# EAGLE schematic rx08-vrs (EAGLE 6.6.0)
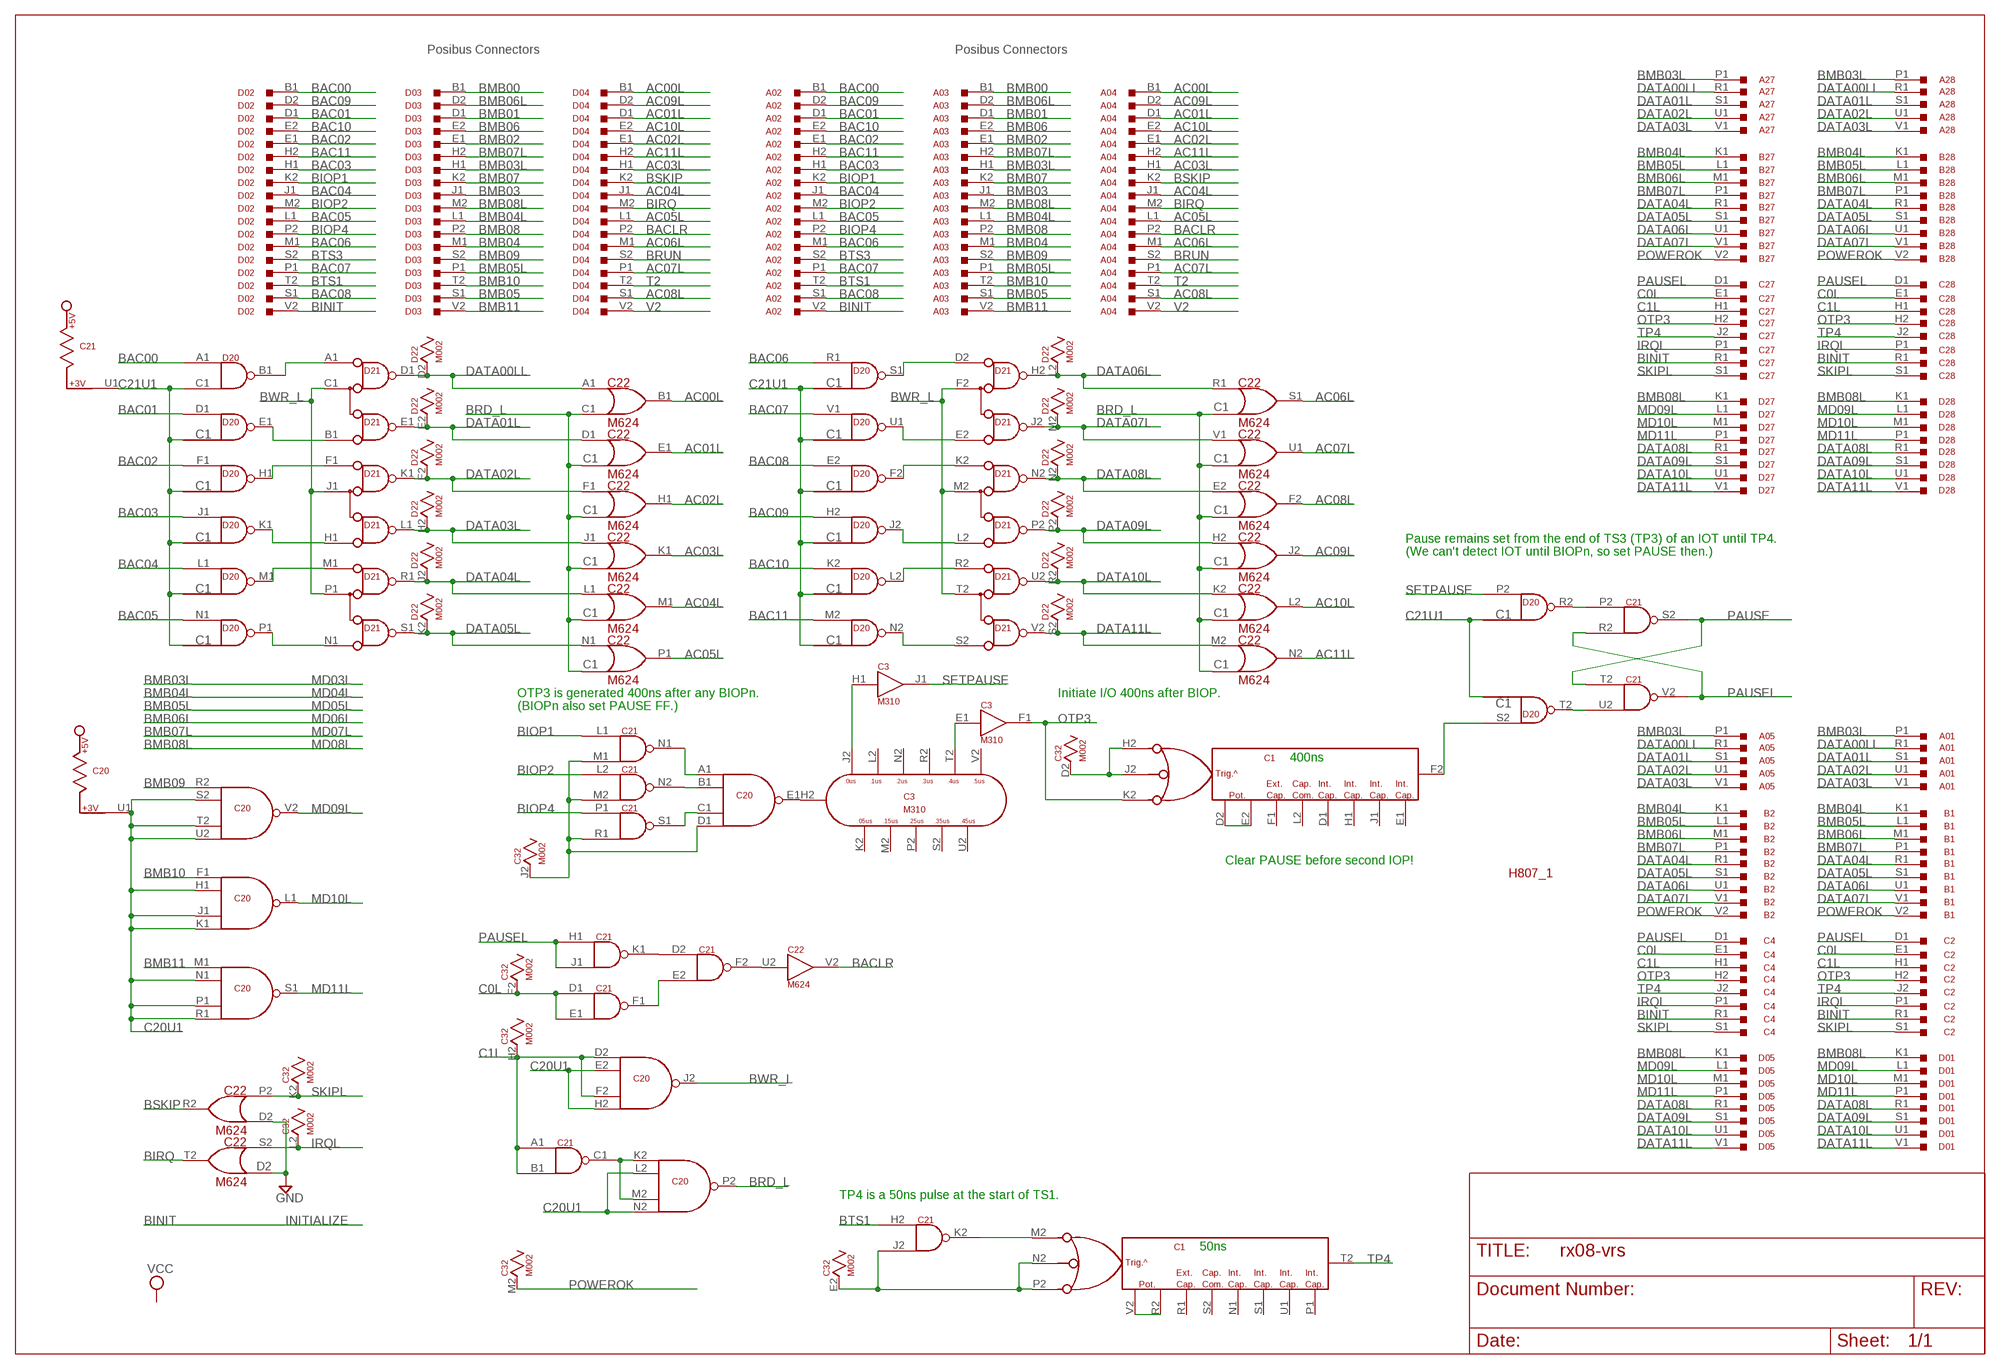
[diagram p0: schematic, sheet 1]

## Parts
A01  M916  [H807]
A02  M903  [H807]
A03  M903  [H807]
A04  M903  [H807]
A05  M916  [H807]
A27  M916  [H807]
A28  M916  [H807]
B1  M916  [H807]
B2  M916  [H807]
B27  M916  [H807]
B28  M916  [H807]
C1  M302  [H807]
C2  M916  [H807]
C3  M310  [H807]
C4  M916  [H807]
C20  M617  [H807]
C21  M113  [H807]
C22  M624  [H807]
C27  M916  [H807]
C28  M916  [H807]
C32  M002  [H807]
D01  M916  [H807]
D02  M903  [H807]
D03  M903  [H807]
D04  M903  [H807]
D05  M916  [H807]
D20  M101  [H807]
D21  M623  [H807]
D22  M002  [H807]
D27  M916  [H807]
D28  M916  [H807]
H807_1  H807  [H807]

## Nets
AC00L: A04.B1 C22.B1(B1:OUT) D04.B1
AC01L: A04.D1 C22.E1(E1:OUT) D04.D1
AC02L: A04.E1 C22.H1(H1:OUT) D04.E1
AC03L: A04.H1 C22.K1(K1:OUT) D04.H1
AC04L: A04.J1 C22.M1(M1:OUT) D04.J1
AC05L: A04.L1 C22.P1(P1:OUT) D04.L1
AC06L: A04.M1 C22.S1(S1:OUT) D04.M1
AC07L: A04.P1 C22.U1(U1:OUT) D04.P1
AC08L: A04.S1 C22.F2(F2:OUT) D04.S1
AC09L: A04.D2 C22.J2(J2:OUT) D04.D2
AC10L: A04.E2 C22.L2(L2:OUT) D04.E2
AC11L: A04.H2 C22.N2(N2:OUT) D04.H2
BAC00: A02.B1 D02.B1 D20.A1(B1:IN1)
BAC01: A02.D1 D02.D1 D20.D1(E1:IN)
BAC02: A02.E1 D02.E1 D20.F1(H1:IN)
BAC03: A02.H1 D02.H1 D20.J1(K1:IN)
BAC04: A02.J1 D02.J1 D20.L1(M1:IN)
BAC05: A02.L1 D02.L1 D20.N1(P1:IN)
BAC06: A02.M1 D02.M1 D20.R1(S1:IN)
BAC07: A02.P1 D02.P1 D20.V1(U1:IN)
BAC08: A02.S1 D02.S1 D20.E2(F2:IN)
BAC09: A02.D2 D02.D2 D20.H2(J2:IN)
BAC10: A02.E2 D02.E2 D20.K2(L2:IN)
BAC11: A02.H2 D02.H2 D20.M2(N2:IN)
BACLR: A04.P2 C22.V2(V2:OUT) D04.P2
BINIT: A02.V2 C2.R1 C4.R1 C27.R1 C28.R1 D02.V2
BIOP1: A02.K2 C21.L1(N1:IN1) D02.K2
BIOP2: A02.M2 C21.L2(N2:IN1) D02.M2
BIOP4: A02.P2 C21.P1(S1:IN1) D02.P2
BIRQ: A04.M2 C22.T2(T2:OUT) D04.M2
BMB00: A03.B1 D03.B1
BMB01: A03.D1 D03.D1
BMB02: A03.E1 D03.E1
BMB03: A03.J1 D03.J1
BMB03L: A01.P1 A03.H1 A05.P1 A27.P1 A28.P1 D03.H1
BMB04: A03.M1 D03.M1
BMB04L: A03.L1 B1.K1 B2.K1 B27.K1 B28.K1 D03.L1
BMB05: A03.S1 D03.S1
BMB05L: A03.P1 B1.L1 B2.L1 B27.L1 B28.L1 D03.P1
BMB06: A03.E2 D03.E2
BMB06L: A03.D2 B1.M1 B2.M1 B27.M1 B28.M1 D03.D2
BMB07: A03.K2 D03.K2
BMB07L: A03.H2 B1.P1 B2.P1 B27.P1 B28.P1 D03.H2
BMB08: A03.P2 D03.P2
BMB08L: A03.M2 D01.K1 D03.M2 D05.K1 D27.K1 D28.K1
BMB09: A03.S2 C20.R2(V2:IN1) D03.S2
BMB10: A03.T2 C20.F1(L1:IN1) D03.T2
BMB11: A03.V2 C20.M1(S1:IN1) D03.V2
BRD_L: C20.P2(P2:OUT) C22.C1(B1:IN2)
BRUN: A04.S2 D04.S2
BSKIP: A04.K2 C22.R2(R2:OUT) D04.K2
BTS1: A02.T2 C21.H2(K2:IN1) D02.T2
BTS3: A02.S2 D02.S2
BWR_L: C20.J2(J2:OUT) D21.C1(D1:C) D21.F2(H2:C) D21.J1(K1:C) D21.M2(N2:C) D21.P1(R1:C) D21.T2(U2:C)
C0L: C2.E1 C4.E1 C21.D1(F1:IN1) C21.E1(F1:IN2) C27.E1 C28.E1 C32.F2
C1L: C2.H1 C4.H1 C20.D2(J2:IN1) C20.F2(J2:IN3) C21.A1(C1:IN1) C21.B1(C1:IN2) C27.H1 C28.H1 C32.H2
C20U1: C20.E2(J2:IN2) C20.H1(L1:IN2) C20.H2(J2:IN4) C20.J1(L1:IN3) C20.K1(L1:IN4) C20.L2(P2:IN2) C20.N1(S1:IN2) C20.N2(P2:IN4) C20.P1(S1:IN3) C20.R1(S1:IN4) C20.S2(V2:IN2) C20.T2(V2:IN3) C20.U1 C20.U2(V2:IN4)
C21U1: C21.U1 D20.C1(B1:IN2)
DATA00LL: A01.R1 A05.R1 A27.R1 A28.R1 C22.A1(B1:IN1) D21.D1(D1:D) D22.D2
DATA01L: A01.S1 A05.S1 A27.S1 A28.S1 C22.D1(E1:IN) D21.E1(D1:E) D22.E2
DATA02L: A01.U1 A05.U1 A27.U1 A28.U1 C22.F1(H1:IN) D21.K1(K1:D) D22.F2
DATA03L: A01.V1 A05.V1 A27.V1 A28.V1 C22.J1(K1:IN) D21.L1(K1:E) D22.H2
DATA04L: B1.R1 B2.R1 B27.R1 B28.R1 C22.L1(M1:IN) D21.R1(R1:D) D22.J2
DATA05L: B1.S1 B2.S1 B27.S1 B28.S1 C22.N1(P1:IN) D21.S1(R1:E) D22.K2
DATA06L: B1.U1 B2.U1 B27.U1 B28.U1 C22.R1(S1:IN) D21.H2(H2:D) D22.L2
DATA07L: B1.V1 B2.V1 B27.V1 B28.V1 C22.V1(U1:IN) D21.J2(H2:E) D22.M2
DATA08L: C22.E2(F2:IN) D01.R1 D05.R1 D21.N2(N2:D) D22.N2 D27.R1 D28.R1
DATA09L: C22.H2(J2:IN) D01.S1 D05.S1 D21.P2(N2:E) D22.P2 D27.S1 D28.S1
DATA10L: C22.K2(L2:IN) D01.U1 D05.U1 D21.U2(U2:D) D22.R2 D27.U1 D28.U1
DATA11L: C22.M2(N2:IN) D01.V1 D05.V1 D21.V2(U2:E) D22.S2 D27.V1 D28.V1
GND: C22.D2(R2:IN2)
IRQL: C2.P1 C4.P1 C22.S2(T2:IN) C27.P1 C28.P1 C32.L2
MD09L: C20.V2(V2:OUT) D01.L1 D05.L1 D27.L1 D28.L1
MD10L: C20.L1(L1:OUT) D01.M1 D05.M1 D27.M1 D28.M1
MD11L: C20.S1(S1:OUT) D01.P1 D05.P1 D27.P1 D28.P1
N$1: D20.B1(B1:OUT) D21.A1(D1:A)
N$2: D20.E1(E1:OUT) D21.B1(D1:B)
N$3: D20.H1(H1:OUT) D21.F1(K1:A)
N$4: D20.K1(K1:OUT) D21.H1(K1:B)
N$5: D20.P1(P1:OUT) D21.N1(R1:B)
N$6: D20.M1(M1:OUT) D21.M1(R1:A)
N$7: C20.K2(P2:IN1) C20.M2(P2:IN3) C21.C1(C1:OUT)
N$8: D20.N2(N2:OUT) D21.S2(U2:B)
N$9: C1.F2(F2:F2) D20.S2(T2:IN)
N$10: D20.J2(J2:OUT) D21.L2(N2:B)
N$11: D20.U1(U1:OUT) D21.E2(H2:B)
N$12: D20.S1(S1:OUT) D21.D2(H2:A)
N$13: D20.F2(F2:OUT) D21.K2(N2:A)
N$14: D20.L2(L2:OUT) D21.R2(U2:A)
N$15: C21.P2(S2:IN1) D20.R2(R2:OUT)
N$16: C1.H2(F2:H2) C1.J2(F2:J2) C32.D2
N$17: C21.U2(V2:IN2) D20.T2(T2:OUT)
N$19: C21.E2(F2:IN2) C21.F1(F1:OUT)
N$20: C21.D2(F2:IN1) C21.K1(K1:OUT)
N$23: C21.F2(F2:OUT) C22.U2(V2:IN)
N$27: C3.H2(H2:H2) C20.E1(E1:OUT)
N$31: C3.E1(F1:IN) C3.T2(H2:T2)
N$32: C20.C1(E1:IN3) C21.S1(S1:OUT)
N$33: C20.A1(E1:IN1) C21.N1(N1:OUT)
N$34: C20.B1(E1:IN2) C21.N2(N2:OUT)
N$35: C1.D2(F2:D2) C1.E2(F2:E2)
N$36: C1.M2(T2:H2) C21.K2(K2:OUT)
N$37: C1.R2(T2:E2) C1.V2(T2:D2)
N$38: C3.H1(J1:IN) C3.J2(H2:J2)
N$40: C1.N2(T2:J2) C1.P2(T2:K2) C21.J2(K2:IN2) C32.E2
N$43: C20.D1(E1:IN4) C21.M1(N1:IN2) C21.M2(N2:IN2) C21.R1(S1:IN2) C32.J2
OTP3: C1.K2(F2:K2) C2.H2 C3.F1(F1:OUT) C4.H2 C27.H2 C28.H2
PAUSE: C21.S2(S2:OUT) C21.T2(V2:IN1)
PAUSEL: C2.D1 C4.D1 C21.H1(K1:IN1) C21.J1(K1:IN2) C21.R2(S2:IN2) C21.V2(V2:OUT) C27.D1 C28.D1
POWEROK: B1.V2 B2.V2 B27.V2 B28.V2 C32.M2
SETPAUSE: C3.J1(J1:OUT) D20.P2(R2:IN)
SKIPL: C2.S1 C4.S1 C22.P2(R2:IN1) C27.S1 C28.S1 C32.K2
T2: A04.T2 D04.T2
TP4: C1.T2(T2:F2) C2.J2 C4.J2 C27.J2 C28.J2
V2: A04.V2 D04.V2
Unconnected: A01.A1 A01.A2 A01.B1 A01.B2 A01.C1 A01.C2 A01.D1 A01.D2 A01.E1 A01.E2 A01.F1 A01.F2 A01.H1 A01.H2 A01.J1 A01.J2 A01.K1 A01.K2 A01.L1 A01.L2 A01.M1 A01.M2 A01.N1 A01.N2 A01.P2 A01.R2 A01.S2 A01.T1 A01.T2 A01.U2 A01.V2 A05.A1 A05.A2 A05.B1 A05.B2 A05.C1 A05.C2 A05.D1 A05.D2 A05.E1 A05.E2 A05.F1 A05.F2 A05.H1 A05.H2 A05.J1 A05.J2 A05.K1 A05.K2 A05.L1 A05.L2 A05.M1 A05.M2 A05.N1 A05.N2 A05.P2 A05.R2 A05.S2 A05.T1 A05.T2 A05.U2 A05.V2 A27.A1 A27.A2 A27.B1 A27.B2 A27.C1 A27.C2 A27.D1 A27.D2 A27.E1 A27.E2 A27.F1 A27.F2 A27.H1 A27.H2 A27.J1 A27.J2 A27.K1 A27.K2 A27.L1 A27.L2 A27.M1 A27.M2 A27.N1 A27.N2 A27.P2 A27.R2 A27.S2 A27.T1 A27.T2 A27.U2 A27.V2 A28.A1 A28.A2 A28.B1 A28.B2 A28.C1 A28.C2 A28.D1 A28.D2 A28.E1 A28.E2 A28.F1 A28.F2 A28.H1 A28.H2 A28.J1 A28.J2 A28.K1 A28.K2 A28.L1 A28.L2 A28.M1 A28.M2 A28.N1 A28.N2 A28.P2 A28.R2 A28.S2 A28.T1 A28.T2 A28.U2 A28.V2 B1.A1 B1.A2 B1.B1 B1.B2 B1.C1 B1.C2 B1.D1 B1.D2 B1.E1 B1.E2 B1.F1 B1.F2 B1.H1 B1.H2 B1.J1 B1.J2 B1.K2 B1.L2 B1.M2 B1.N1 B1.N2 B1.P2 B1.R2 B1.S2 B1.T1 B1.T2 B1.U2 B2.A1 B2.A2 B2.B1 B2.B2 B2.C1 B2.C2 B2.D1 B2.D2 B2.E1 B2.E2 B2.F1 B2.F2 B2.H1 B2.H2 B2.J1 B2.J2 B2.K2 B2.L2 B2.M2 B2.N1 B2.N2 B2.P2 B2.R2 B2.S2 B2.T1 B2.T2 B2.U2 B27.A1 B27.A2 B27.B1 B27.B2 B27.C1 B27.C2 B27.D1 B27.D2 B27.E1 B27.E2 B27.F1 B27.F2 B27.H1 B27.H2 B27.J1 B27.J2 B27.K2 B27.L2 B27.M2 B27.N1 B27.N2 B27.P2 B27.R2 B27.S2 B27.T1 B27.T2 B27.U2 B28.A1 B28.A2 B28.B1 B28.B2 B28.C1 B28.C2 B28.D1 B28.D2 B28.E1 B28.E2 B28.F1 B28.F2 B28.H1 B28.H2 B28.J1 B28.J2 B28.K2 B28.L2 B28.M2 B28.N1 B28.N2 B28.P2 B28.R2 B28.S2 B28.T1 B28.T2 B28.U2 C1.D1(F2:D1) C1.E1(F2:E1) C1.F1(F2:F1) C1.H1(F2:H1) C1.J1(F2:J1) C1.L2(F2:L2) C1.N1(T2:D1) C1.P1(T2:E1) C1.R1(T2:F1) C1.S1(T2:H1) C1.S2(T2:L2) C1.U1(T2:J1) C2.A1 C2.A2 C2.B1 C2.B2 C2.C1 C2.C2 C2.D2 C2.E2 C2.F1 C2.F2 C2.J1 C2.K1 C2.K2 C2.L1 C2.L2 C2.M1 C2.M2 C2.N1 C2.N2 C2.P2 C2.R2 C2.S2 C2.T1 C2.T2 C2.U1 C2.U2 C2.V1 C2.V2 C3.K2(H2:K2) C3.L2(H2:L2) C3.M2(H2:M2) C3.N2(H2:N2) C3.P2(H2:P2) C3.R2(H2:R2) C3.S2(H2:S2) C3.U2(H2:U2) C3.V2(H2:V2) C4.A1 C4.A2 C4.B1 C4.B2 C4.C1 C4.C2 C4.D2 C4.E2 C4.F1 C4.F2 C4.J1 C4.K1 C4.K2 C4.L1 C4.L2 C4.M1 C4.M2 C4.N1 C4.N2 C4.P2 C4.R2 C4.S2 C4.T1 C4.T2 C4.U1 C4.U2 C4.V1 C4.V2 C20.V1 C21.V1 C27.A1 C27.A2 C27.B1 C27.B2 C27.C1 C27.C2 C27.D2 C27.E2 C27.F1 C27.F2 C27.J1 C27.K1 C27.K2 C27.L1 C27.L2 C27.M1 C27.M2 C27.N1 C27.N2 C27.P2 C27.R2 C27.S2 C27.T1 C27.T2 C27.U1 C27.U2 C27.V1 C27.V2 C28.A1 C28.A2 C28.B1 C28.B2 C28.C1 C28.C2 C28.D2 C28.E2 C28.F1 C28.F2 C28.J1 C28.K1 C28.K2 C28.L1 C28.L2 C28.M1 C28.M2 C28.N1 C28.N2 C28.P2 C28.R2 C28.S2 C28.T1 C28.T2 C28.U1 C28.U2 C28.V1 C28.V2 C32.N2 C32.P2 C32.R2 C32.S2 C32.T2 C32.U2 C32.V2 D01.A1 D01.A2 D01.B1 D01.B2 D01.C1 D01.C2 D01.D1 D01.D2 D01.E1 D01.E2 D01.F1 D01.F2 D01.H1 D01.H2 D01.J1 D01.J2 D01.K2 D01.L2 D01.M2 D01.N1 D01.N2 D01.P2 D01.R2 D01.S2 D01.T1 D01.T2 D01.U2 D01.V2 D05.A1 D05.A2 D05.B1 D05.B2 D05.C1 D05.C2 D05.D1 D05.D2 D05.E1 D05.E2 D05.F1 D05.F2 D05.H1 D05.H2 D05.J1 D05.J2 D05.K2 D05.L2 D05.M2 D05.N1 D05.N2 D05.P2 D05.R2 D05.S2 D05.T1 D05.T2 D05.U2 D05.V2 D20.U2(V2:IN) D20.V2(V2:OUT) D22.T2 D22.U2 D22.V2 D27.A1 D27.A2 D27.B1 D27.B2 D27.C1 D27.C2 D27.D1 D27.D2 D27.E1 D27.E2 D27.F1 D27.F2 D27.H1 D27.H2 D27.J1 D27.J2 D27.K2 D27.L2 D27.M2 D27.N1 D27.N2 D27.P2 D27.R2 D27.S2 D27.T1 D27.T2 D27.U2 D27.V2 D28.A1 D28.A2 D28.B1 D28.B2 D28.C1 D28.C2 D28.D1 D28.D2 D28.E1 D28.E2 D28.F1 D28.F2 D28.H1 D28.H2 D28.J1 D28.J2 D28.K2 D28.L2 D28.M2 D28.N1 D28.N2 D28.P2 D28.R2 D28.S2 D28.T1 D28.T2 D28.U2 D28.V2

## Notes on the sheet
- Posibus Connectors | Posibus Connectors
- Pause remains set from the end of TS3 (TP3) of an IOT until TP4.
- (We can't detect IOT until BIOPn, so set PAUSE then.)
- MD03L
- MD04L | OTP3 is generated 400ns after any BIOPn. | Initiate I/O 400ns after BIOP.
- MD05L | (BIOPn also set PAUSE FF.)
- MD06L
- MD07L
- MD08L
- 400ns
- Clear PAUSE before second IOP!
- TP4 is a 50ns pulse at the start of TS1.
- INITIALIZE
- 50ns

## Power pins joined to a net without a drawn wire
GND: A02.A1 A02.C1 A02.C2 A02.F1 A02.F2 A02.J2 A02.K1 A02.L2 A02.N1 A02.N2 A02.R1 A02.R2 A02.T1 A02.U2 A03.A1 A03.C1 A03.C2 A03.F1 A03.F2 A03.J2 A03.K1 A03.L2 A03.N1 A03.N2 A03.R1 A03.R2 A03.T1 A03.U2 A04.A1 A04.C1 A04.C2 A04.F1 A04.F2 A04.J2 A04.K1 A04.L2 A04.N1 A04.N2 A04.R1 A04.R2 A04.T1 A04.U2 C1.C2(GND) C1.T1(GND) C3.C2(GND) C3.T1(GND) C20.C2(GND) C20.T1(GND) C21.C2(GND) C21.T1(GND) C22.C2(GND) C22.T1(GND) C32.C2(GND) D02.A1 D02.C1 D02.C2 D02.F1 D02.F2 D02.J2 D02.K1 D02.L2 D02.N1 D02.N2 D02.R1 D02.R2 D02.T1 D02.U2 D03.A1 D03.C1 D03.C2 D03.F1 D03.F2 D03.J2 D03.K1 D03.L2 D03.N1 D03.N2 D03.R1 D03.R2 D03.T1 D03.U2 D04.A1 D04.C1 D04.C2 D04.F1 D04.F2 D04.J2 D04.K1 D04.L2 D04.N1 D04.N2 D04.R1 D04.R2 D04.T1 D04.U2 D20.C2(GND) D20.T1(GND) D21.C2(GND) D21.T1(GND) D21.U1(GND) D21.V1(GND) D22.C2(GND)
VCC: C1.A2(VCC) C3.A2(VCC) C20.A2(VCC) C21.A2(VCC) C22.A2(VCC) C32.A2(VCC) D20.A2(VCC) D21.A2(VCC) D22.A2(VCC)

## Library data of the parts
A01 A05 A27 A28 B1 B2 B27 B28 C2 C4 C27 C28 D01 D05 D27 D28 = dec-m:M916: Simple 36 pin connector/wire cable
A02-A04 D02-D04 = dec-m:M903: Two-sided Posibus cable/connector.
C1 = dec-m:M302: Dual one-shot
C3 = dec-m:M310: Tapped Delay Line
C20 = dec-m:M617: 6 4-input NAND Buffers
C21 = dec-m:M113: 10 2-input NAND Gates
C22 = dec-m:M624: Bus Data Interface The M101 contains 15 two-input NAND gates. One input of each gate is tied to a common line so that all data signals can be enabled simultaneously. Each data signal presents one TTL load. The common input presents 15 loads. Each output can drive 10 loads. Power: 5V@82ma (max.)
C32 D22 = dec-m:M002: 15 Clamped Loads
D20 = dec-m:M101: Bus Data Interface The M101 contains 15 two-input NAND gates. One input of each gate is tied to a common line so that all data signals can be enabled simultaneously. Each data signal presents one TTL load. The common input presents 15 loads. Each output can drive 10 loads. Power: 5V@82ma (max.)
D21 = dec-m:M623: 6 Dual Bus Drivers
H807_1 = dec-m:H807: Empty card slot

## Net classes
1 Supply: width 1.905 mm, clearance 0.508 mm